# EAGLE design untitled (EAGLE 7.7.0)
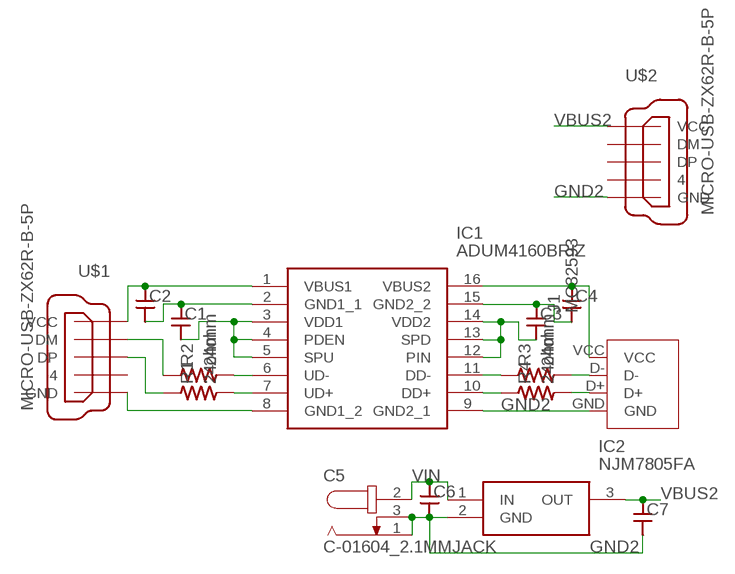
[diagram p0: schematic, sheet 1]

## Parts
C1  CAPACITOR2012  [SMD2012]
C2  CAPACITOR2012  [SMD2012]
C3  CAPACITOR2012  [SMD2012]
C4  CAPACITOR2012  [SMD2012]
C5  C-01604_2.1MMJACK  [2.1MMJACK]
C6  CAPACITOR2012  [SMD2012]
C7  CAPACITOR2012  [SMD2012]
IC1  ADUM4160BRIZ  [SOIC127P1032X265-16N]
IC2  NJM7805FA  [TO254P500X1000X2170-3P]
J1  MC32593  [MC32593]
R1  24ohm  RESISTOR-US1608  [SMD1608]
R2  24ohm  RESISTOR-US1608  [SMD1608]
R3  24ohm  RESISTOR-US1608  [SMD1608]
R4  24ohm  RESISTOR-US1608  [SMD1608]
U$1  MICRO-USB-ZX62R-B-5P  [ZX62R-B-5P]
U$2  MICRO-USB-ZX62R-B-5P  [ZX62R-B-5P]

## Nets
D+M: J1.D+ R4.2
D-M: J1.D- R3.2
DD+: IC1.10(DD+) R4.1
DD-: IC1.11(DD-) R3.1
DM: R2.1 U$1.2(DM)
DP: R1.1 U$1.3(DP)
GND1: C1.1 C2.2 IC1.2(GND1_1) IC1.8(GND1_2) U$1.5(GND)
GND2: C3.1 C4.2 C5.1(GND) C5.3(S) C6.2 C7.2 IC1.9(GND2_1) IC1.15(GND2_2) IC2.2(GND) J1.GND U$2.5(GND)
N$1: C3.2 IC1.12(PIN) IC1.13(SPD) IC1.14(VDD2)
UD+: IC1.7(UD+) R1.2
UD-: IC1.6(UD-) R2.2
VBUS1: C2.1 IC1.1(VBUS1) U$1.1(VCC)
VBUS2: C4.1 C7.1 IC1.16(VBUS2) IC2.3(OUT) J1.VCC U$2.1(VCC)
VDD1: C1.2 IC1.3(VDD1) IC1.4(PDEN) IC1.5(SPU)
VIN: C5.2(VCC) C6.1 IC2.1(IN)
Unconnected: U$1.4 U$2.2(DM) U$2.3(DP) U$2.4

## Library data of the parts
C1-C4 C6 C7 = generic:CAPACITOR: Generic Capacitor
C5 = Akizuki:C-01604_2.1MMJACK
IC1 = ADUM4160BRIZ:ADUM4160BRIZ: USB Digital Isolator 2:2 12Mbps 5kV SO16 Analog Devices ADUM4160BRIZ PCB SMT USB Digital Isolator, 5 kVrms, 16-Pin SO Source: Datasheet <http://uk.rs-online.com/web/p/products/7593054>; DESCRIPTION: USB Digital Isolator 2:2 12Mbps 5kV SO16 Analog Devices ADUM4160BRIZ PCB SMT USB Digital Isolator, 5 kVrms, 16-Pin SO; HEIGHT: 2.65mm; MANUFACTURER_NAME: Analog Devices; MANUFACTURER_PART_NUMBER: ADUM4160BRIZ; MOUSER_PART_NUMBER: 584-ADUM4160BRIZ; MOUSER_PRICE-STOCK: https://www.mouser.com/Search/Refine.aspx?Keyword=584-ADUM4160BRIZ; RS_PART_NUMBER: 9129894; RS_PRICE-STOCK: https://uk.rs-online.com/web/p/products/9129894
IC2 = NJM7805FA:NJM7805FA: Linear Voltage Regulators 5V 1.5A 3 Terminal Source: Datasheet <http://www.njr.com/semicon/PDF/NJM7800_E.pdf>; ARROW_PART_NUMBER: NJM7805FA; DESCRIPTION: Linear Voltage Regulators 5V 1.5A 3 Terminal; HEIGHT: 5mm; MANUFACTURER_NAME: NJR; MANUFACTURER_PART_NUMBER: NJM7805FA
J1 = MC32593:MC32593: USB Socket Type A, R/A Source: Datasheet <http://www.farnell.com/datasheets/1673634.pdf>; DESCRIPTION: USB Socket Type A, R/A; HEIGHT: mm; MANUFACTURER_NAME: MULTICOMP; MANUFACTURER_PART_NUMBER: MC32593
R1-R4 = generic:RESISTOR-US: Generic Registor
U$1 U$2 = con-hirose:MICRO-USB-: Hirose Micro USB Connector ZX62R-B-5P: Micro B, reverse (top mount) shell SMT Supplier: DigiKey H11574CT-ND Source: http://www.hirose.co.jp/cataloge_hp/e24200011.pdf

## Board
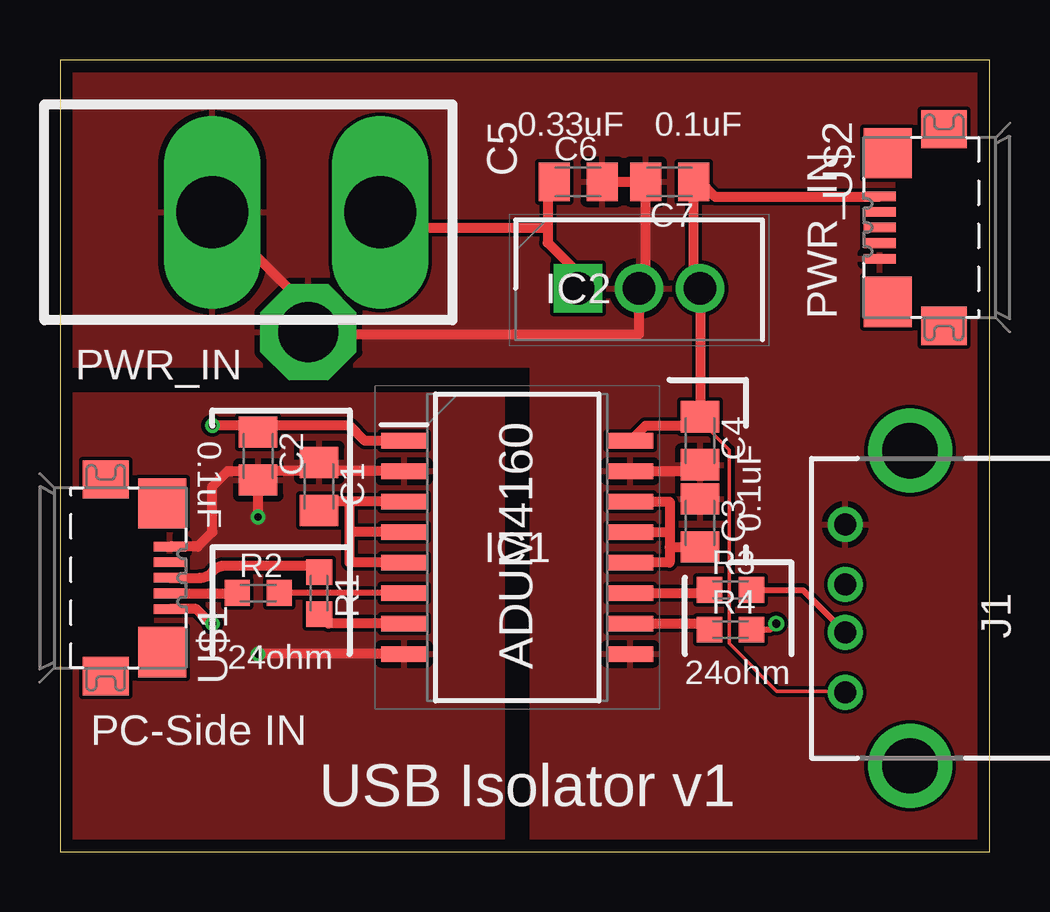
[diagram p1: board, top side]
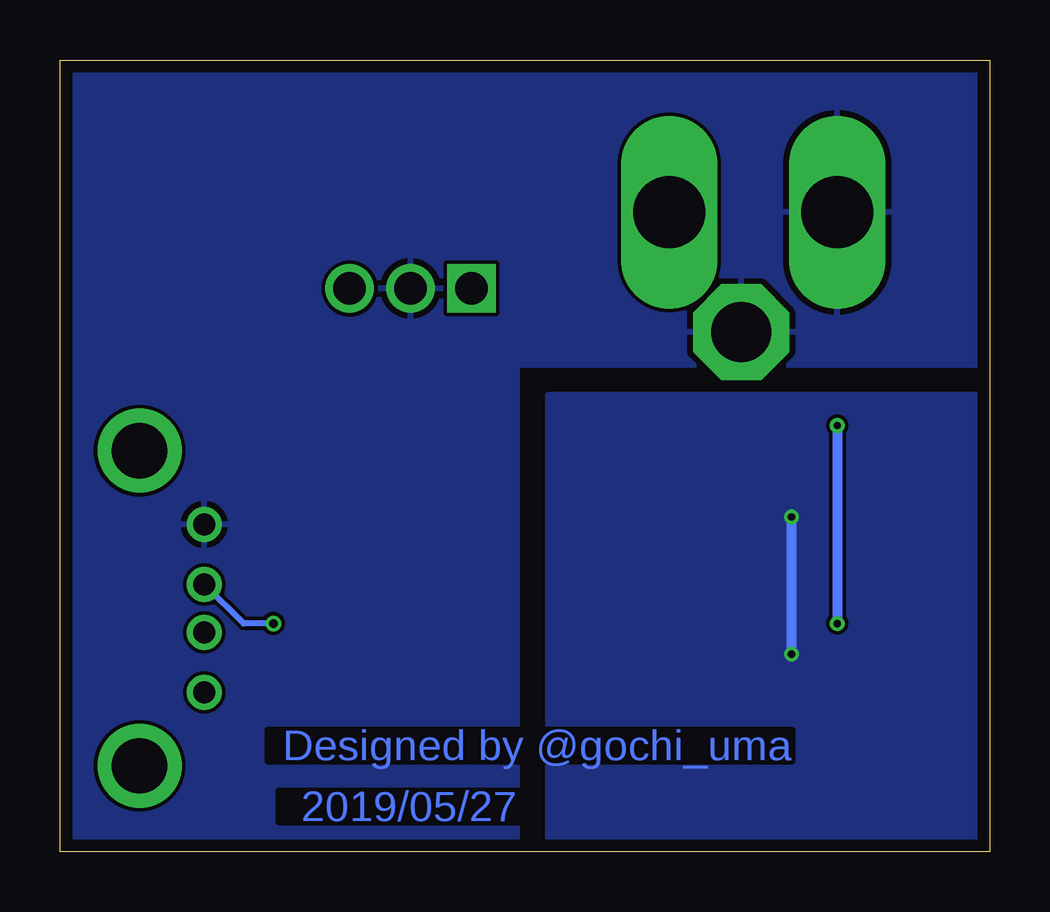
[diagram p2: board, bottom side, seen from below]

Size 38.73 x 33.02 mm. Coordinates in mm from the lower left corner, seen from the top.
Outline: 0,0 38.73,0 38.73,33.02 0,33.02 0,0
Copper layers (1*16): Top 0.035mm / dielectric 1.6mm / Bottom 0.035mm
Design rules "Elecrow_2-layer_PCB_eagle_rule": minimum track width 6mil, minimum drill 12mil, track to track 6mil, track to pad 6mil, pad to pad 6mil, via to via 8mil, smd to smd 0mil, copper to edge 20mil, drill to drill 10mil, minimum pad ring 6mil, minimum via ring 6mil, stop-mask expansion 0mil, vias tented up to drill 100mil, thermal gap 10mil

### Footprints (pad centres in the part's own frame; a part is rotated, then mirrored left to right if it is on the bottom)
SMD2012 = smd 1.3 x 1.6: 1 -1,0; 2 1,0
2.1MMJACK = drill 3 pad 3.3 long: 1 0,0; 2 0,7 | drill 2.5 pad 4 octagon: 3 5,4
SOIC127P1032X265-16N = smd 1.925 x 0.65: 1 -4.712,4.445; 2 -4.712,3.175; 3 -4.712,1.905; 4 -4.712,0.635; 5 -4.712,-0.635; 6 -4.712,-1.905; 7 -4.712,-3.175; 8 -4.712,-4.445; 9 4.712,-4.445; 10 4.712,-3.175; 11 4.712,-1.905; 12 4.712,-0.635; 13 4.712,0.635; 14 4.712,1.905; 15 4.712,3.175; 16 4.712,4.445
TO254P500X1000X2170-3P = drill 1.35 pad 2.025 square: 1 0,0 | drill 1.35 pad 2.025: 2 2.54,0; 3 5.08,0
MC32593 = drill 2.3 pad 3.5: 5 -6.57,10.3; 6 6.57,10.3 | drill 0.92 pad 1.45: D+ 1,13; D- -1,13; GND 3.5,13; VCC -3.5,13
SMD1608 = smd 1.05 x 1.08: 1 -0.875,0; 2 0.875,0
ZX62R-B-5P = smd 1.35 x 0.4: 1 2.675,-1.3; 2 2.675,-0.65; 3 2.675,0; 4 2.675,0.65; 5 2.675,1.3 | smd 1.9 x 1.6: M1 0,-4.1; M2 0,4.1 | smd 2 x 2.1: M3 2.35,3.1; M4 2.35,-3.1

### Placement (x,y rotation side)
C1  10.79,15.24 270 top
C2  8.26,16.51 270 top
C3  26.67,13.72 270 top
C4  26.67,17.14 270 top
C5  6.35,26.67 270 top
C6  21.59,27.94 0 top
C7  25.4,27.94 180 top
IC1  19.05,12.7 0 top
IC2  21.59,23.5 0 top
J1  45.72,10.16 90 top
R1  10.79,10.79 270 top
R2  8.26,10.79 0 top
R3  27.94,10.92 0 top
R4  27.94,9.27 0 top
U$1  1.91,11.43 0 top
U$2  36.83,26.04 180 top

### Tracks (layer width: path | path; a pad name or v marks a point on that pad's centre or on a via)
D+M  (via drill 0.35)
  Top 0.254: R4.2 29.59,9.27 v29.84,9.53
  Bottom 0.254: v29.84,9.53 31.09,9.53 J1.D+
D-M
  Top 0.254: R3.2 30.96,10.92 J1.D-
DD+
  Top 0.406: IC1.10 26.67,9.53 26.92,9.27 R4.1
DD-
  Top 0.406: IC1.11 26.94,10.79 R3.1
DM
  Top 0.406: U$1.2 7.37,10.78 R2.1
DP
  Top 0.406: U$1.3 5.84,11.43 arc53 6.35,11.68 arc-53 6.86,11.94 10.53,11.94 R1.1
GND1  (via drill 0.3)
  Top 0.406: IC1.2 10.79,15.88 | 10.79,15.88 C1.1 | 10.79,15.88 8.26,15.88 C2.2 | IC1.8 v8.26,8.26 | v8.26,13.97 C2.2 | U$1.5 5.75,12.73 6.35,13.34 6.35,15.24 6.99,15.88 7.62,15.88 7.99,15.51 C2.2
  Bottom 0.406: v8.26,8.26 v8.26,13.97
  pour Bottom: 0,19.05 18.41,19.05 18.41,0 0,0
  pour Top: 0,19.05 18.41,19.05 18.41,0 0,0
GND2
  Top 0.406: IC1.15 26.04,15.88 26.3,16.14 C4.2 | C5.1 10.35,22.67 | 10.35,22.67 C5.3 | C6.2 C7.2 24.4,23.77 IC2.2 24.13,21.59 10.16,21.59 10.16,22.48 10.35,22.67
  pour Bottom: 0,33.02 38.73,33.02 38.73,0 19.68,0 19.68,20.32 0,20.32
  pour Top: 0,20.32 19.68,20.32 19.68,0 38.73,0 38.73,33.02 0,33.02
N$1
  Top 0.406: IC1.14 25.4,14.61 25.4,13.34 | 25.4,12.7 25.4,12.06 IC1.12 | IC1.13 25.4,13.34 | 26.67,12.7 C3.2 25.42,12.72 25.4,12.7 | 25.4,13.34 25.4,12.7
UD+
  Top 0.406: IC1.7 11.19,9.53 R1.2
UD-
  Top 0.254: IC1.6 R2.2
VBUS1  (via drill 0.3)
  Top 0.406: IC1.1 12.7,17.14 12.06,17.78 8.53,17.78 C2.1 7.99,17.78 v6.35,17.78 | U$1.1 5.68,10.13 6.29,9.53 v6.35,9.53
  Bottom 0.406: v6.35,17.78 v6.35,9.53
VBUS2
  Top 0.152: J1.VCC 32.61,6.71 29.87,6.71 27.89,8.69 27.89,16.76 26.67,17.98 C4.1
  Top 0.406: IC1.16 24.4,17.78 26.04,17.78 26.4,18.14 C4.1 IC2.3 26.4,23.77 C7.1 26.67,27.94 27.3,27.3 34.12,27.3 U$2.1
VDD1
  Top 0.406: IC1.4 12.06,13.34 | 12.06,13.34 12.06,14.61 | IC1.3 12.06,14.61 | IC1.5 12.06,12.06 12.06,13.34 | 12.06,14.61 10.79,14.61 C1.2
VIN
  Top 0.406: C6.1 20.32,27.67 20.32,26.04 | 20.32,26.04 20.32,25.4 21.59,24.13 IC2.1 21.59,22.86 | C5.2 13.98,26.04 20.32,26.04

### Text on the board
Bottom: Designed by @gochi_uma | 2019/05/27
_tsilk: 0.33uF | 0.1uF | PWR_IN | PWR_IN | 0.1uF | 0.1uF | 24ohm | ADUM4160 | 24ohm | PC-Side IN | USB Isolator v1